# EasyEDA schematic projeto_eletrico_arquivo.json
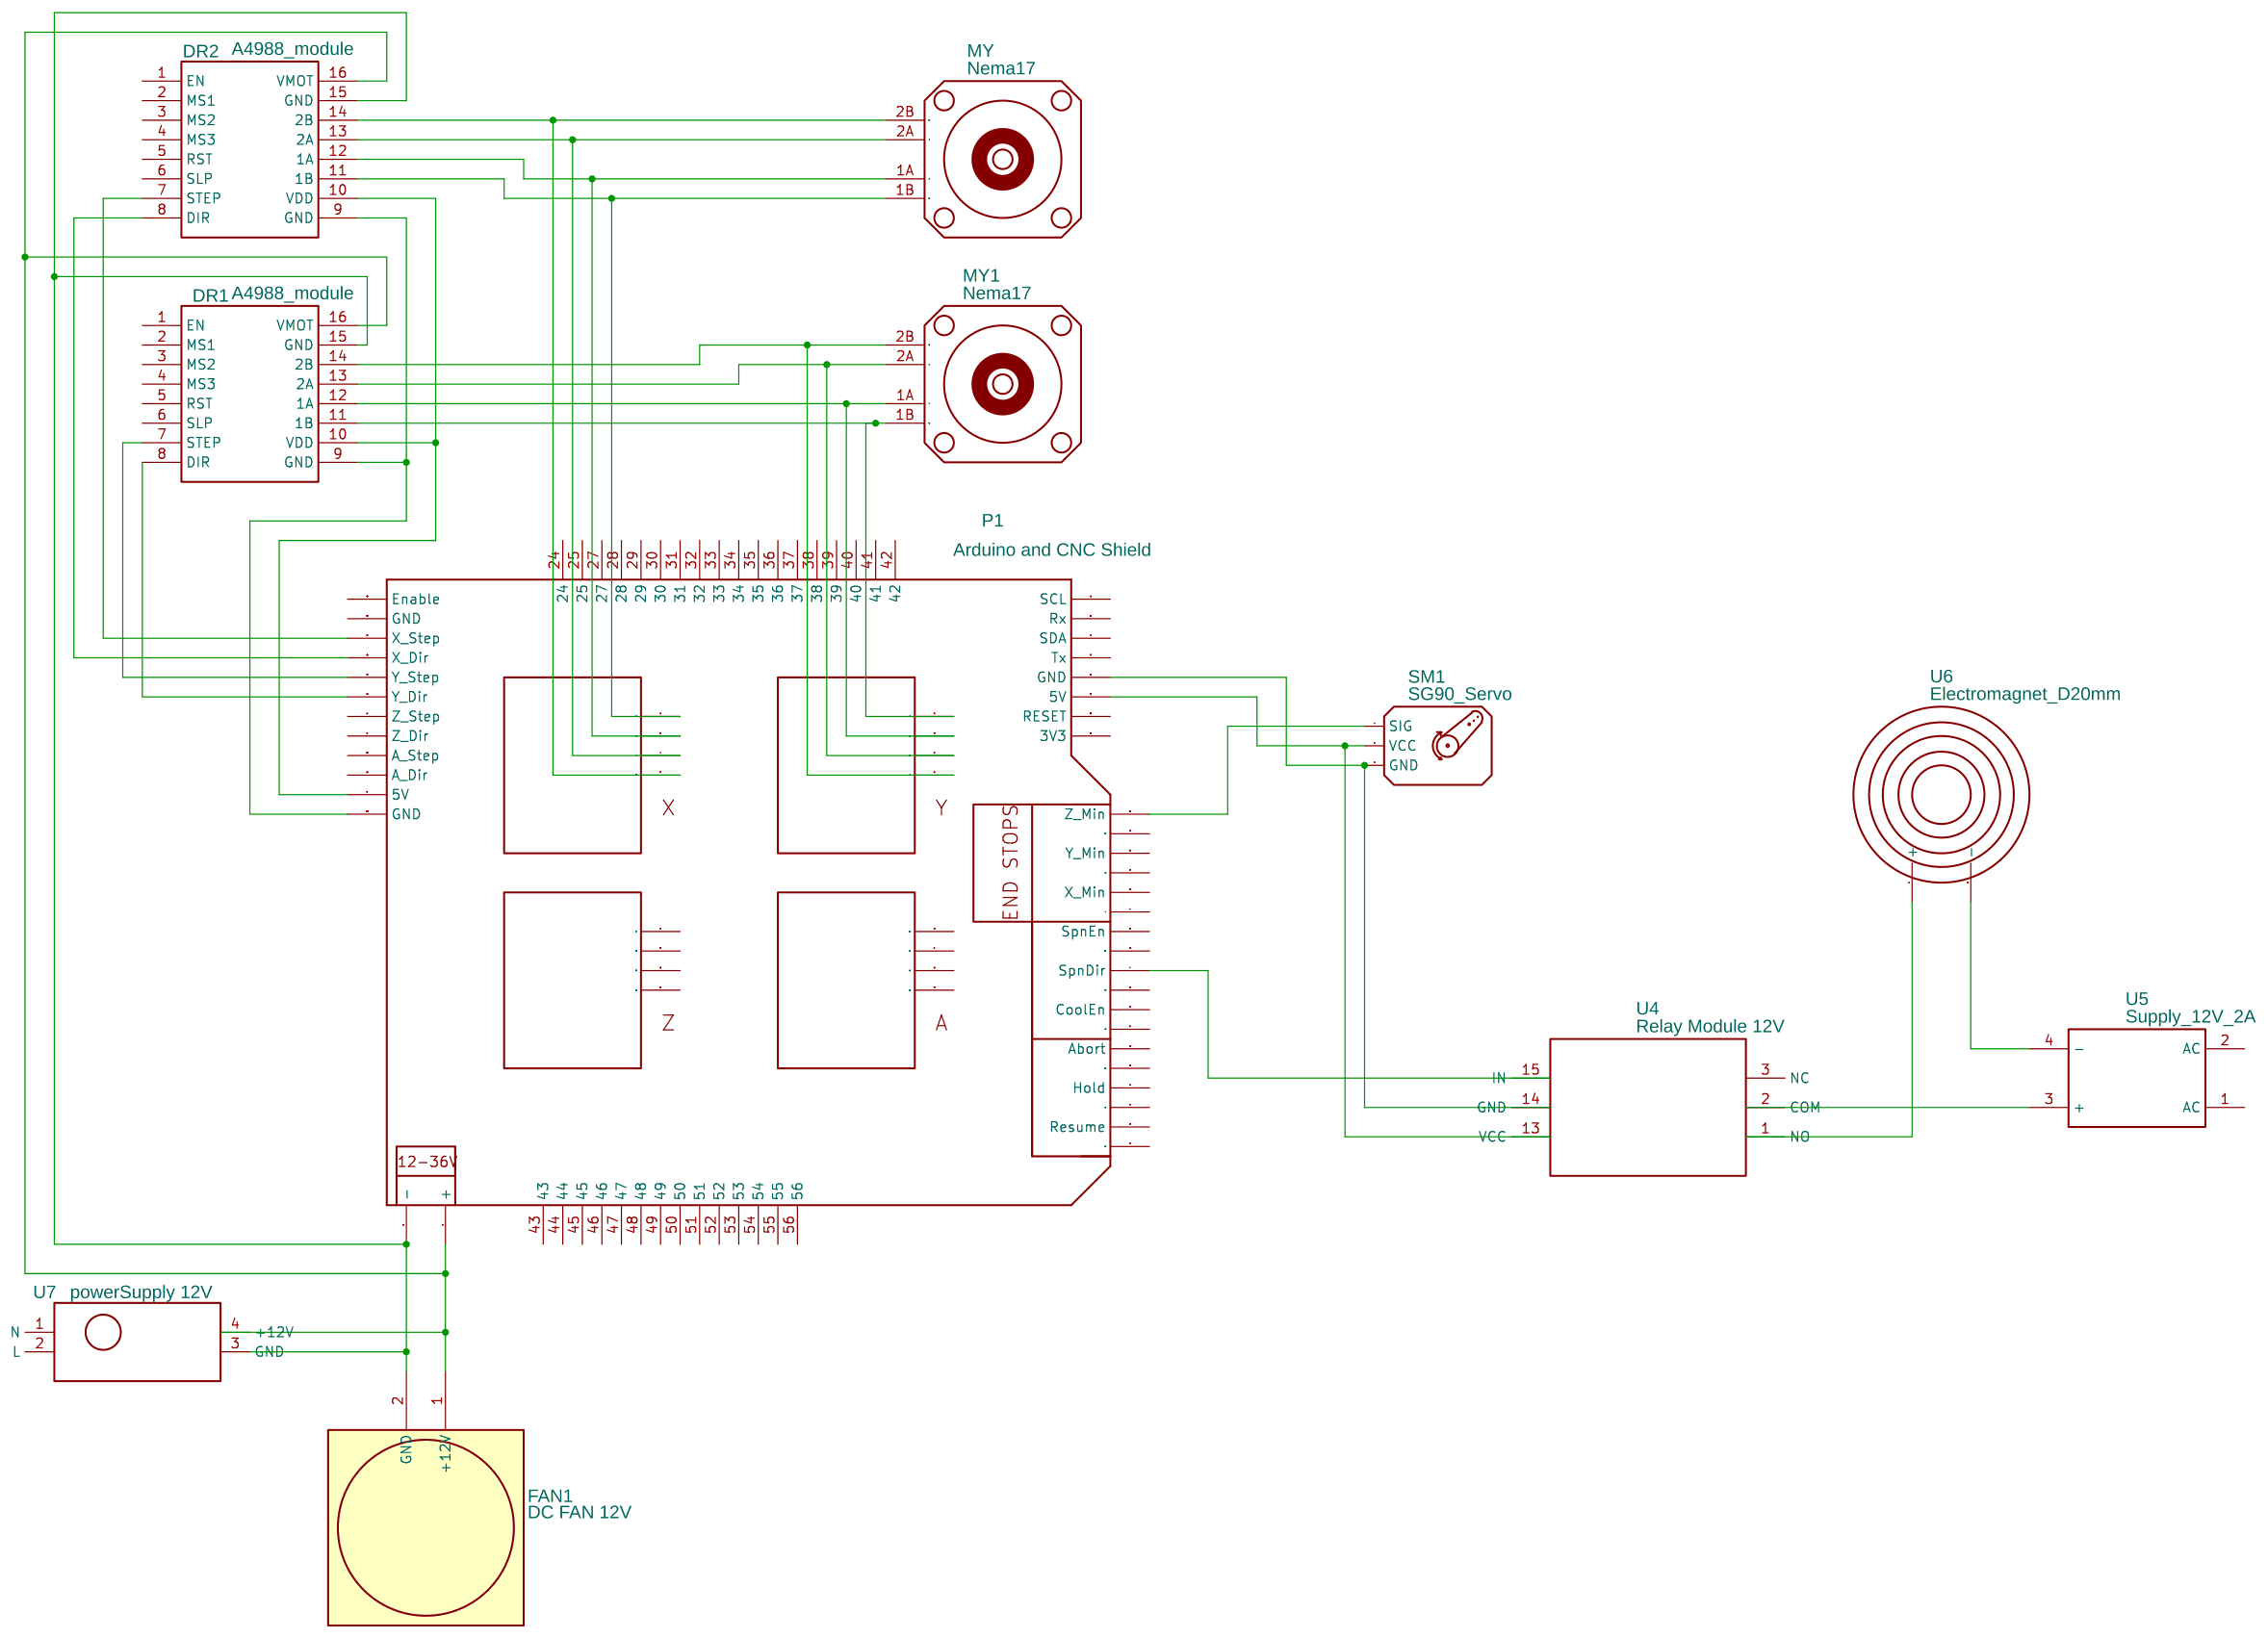
[diagram p0: schematic sheet]

## Parts
DR1  A4988_module  [MYA4988]
DR2  A4988_module  [MYA4988]
FAN1  DC FAN 12V  [FAN]
MY  Nema17  [NEMA17]
MY1  Nema17  [NEMA17]
P1  Arduino and CNC Shield  [CNC_SHIELD]
SM1  SG90_Servo  [SG90]
U4  Relay Module 12V  [12V RELAY MODULE]
U5  Supply_12V_2A  [SUPPLY_12V_2A]
U6  Electromagnet_D20mm  [ELECTROMAGNET_D20MM]
U7  powerSupply 12V  [POWER SUPPLY 12V]

## Library data of the parts
DR1 DR2 = A4988_module: sourceId: Mfr1dNnWU
FAN1 = DC FAN 12V: Contributor: Sutee.S
MY MY1 = Nema17: Contributor: mero.alejandro82
P1 = CNC_Shield: Contributor: gornego
SM1 = SG90_Servo: Contributor: arkanoor09
U4 = 12v Relay Module: Contributor: poramat.sa
U5 = Supply_12V_2A: Contributor: preecha.code.pcb
U6 = Electromagnet_D20mm: Contributor: Andrew Melnikov
U7 = powerSupply 12V: Contributor: c4lic0

## Nets
Net-(DR1-7): DR1.7(STEP) P1.D3(Y_Step)
Net-(DR1-8): DR1.8(DIR) P1.D6(Y_Dir)
Net-(DR1-9): DR1.9(GND) DR2.9(GND) P1.GND2(GND)
Net-(DR1-10): DR1.10(VDD) DR2.10(VDD) P1.5V
Net-(DR1-11): DR1.11(1B) MY1.1B(B) P1.9
Net-(DR1-12): DR1.12(1A) MY1.1A(A) P1.10
Net-(DR1-13): DR1.13(2A) MY1.2A(A) P1.11
Net-(DR1-14): DR1.14(2B) MY1.2B(B) P1.12
Net-(DR1-15): DR1.15(GND) DR2.12(1A) DR2.15(GND) FAN1.2(GND) MY.1A(A) P1.6(SpnEn)
Net-(DR1-16): DR1.16(VMOT) DR2.16(VMOT) FAN1.1(+12V) P1.3 U7.4(+12V)
Net-(DR2-7): DR2.7(STEP) P1.D2(X_Step)
Net-(DR2-8): DR2.8(DIR) P1.D5(X_Dir)
Net-(DR2-11): DR2.11(1B) MY.1B(B) P1.5(SpnEn)
Net-(DR2-13): DR2.13(2A) MY.2A(A) P1.7(SpnDir) U4.15(IN)
Net-(DR2-14): DR2.14(2B) MY.2B(B) P1.8
Net-(P1-21): P1.21(5V) SM1.2(VCC) U4.13(VCC)
Net-(P1-D11): P1.D11(Z_Min) SM1.1(SIG)
Net-(P1-GND1): P1.GND1(GND) SM1.3(GND) U4.14(GND)
Net-(U4-1): U4.1(NO) U6.1(+)
Net-(U4-2): U4.2(COM) U5.3(+)
Net-(U5-4): U5.4(-) U6.2(-)

Not connected (* = marked no-connect by the designer): DR1 1(EN) 2(MS1) 3(MS2) 4(MS3) 5(RST) 6(SLP); DR2 1(EN) 2(MS1) 3(MS2) 4(MS3) 5(RST) 6(SLP); P1 3V(3V3) 4 13 14 15 16 17 18 19 20 22 23 24 25 27 28 29 30 31 32 33 34 35 36 37 38 39 40 41 42 43 44 45 46 47 48 49 50 51 52 53 54 55 56 A0(Abort) A1(Hold) A2(Resume) A3(CoolEn) A4(SDA) A5(SCL) D0(Rx) D1(Tx) D4(Z_Step) D7(Z_Dir) D8(Enable) D9(X_Min) D10(Y_Min) D12(A_Step) D13(A_Dir) GND RESET; U4 3(NC); U5 1(AC) 2(AC); U7 1(N) 2(L) 3(GND)
